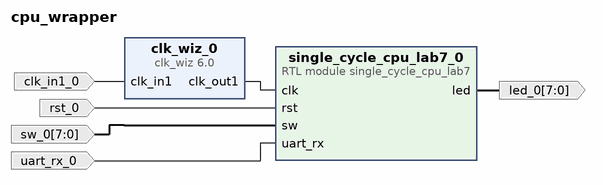
[diagram p0: block diagram of the top level]
# Vivado block design cpu_wrapper, xc7a35tcpg236-1, Vivado 2025.2
create_bd_design cpu_wrapper

create_bd_port -dir O -from 7 -to 0 led_0
create_bd_port -dir I -type rst rst_0
create_bd_port -dir I -from 7 -to 0 sw_0
create_bd_port -dir I uart_rx_0
create_bd_port -dir I -type clk clk_in1_0

create_bd_cell -type module -reference single_cycle_cpu_lab7 single_cycle_cpu_lab7_0
create_bd_cell -type ip -vlnv xilinx.com:ip:clk_wiz:6.0 clk_wiz_0
set_property -dict [list \
  CONFIG.CLKOUT1_JITTER 290.478 \
  CONFIG.CLKOUT1_PHASE_ERROR 133.882 \
  CONFIG.CLKOUT1_REQUESTED_OUT_FREQ 10 \
  CONFIG.MMCM_CLKFBOUT_MULT_F 15.625 \
  CONFIG.MMCM_CLKOUT0_DIVIDE_F 78.125 \
  CONFIG.MMCM_DIVCLK_DIVIDE 2 \
  CONFIG.USE_LOCKED false \
  CONFIG.USE_RESET false \
] [get_bd_cells clk_wiz_0]

# ---- connections ----

connect_bd_net -net clk_in1_0_1 [get_bd_ports clk_in1_0] [get_bd_pins clk_wiz_0/clk_in1]
connect_bd_net [get_bd_pins clk_wiz_0/clk_out1] [get_bd_pins single_cycle_cpu_lab7_0/clk]
connect_bd_net -net rst_0_1 [get_bd_ports rst_0] [get_bd_pins single_cycle_cpu_lab7_0/rst]
connect_bd_net [get_bd_pins single_cycle_cpu_lab7_0/led] [get_bd_ports led_0]
connect_bd_net -net sw_0_1 [get_bd_ports sw_0] [get_bd_pins single_cycle_cpu_lab7_0/sw]
connect_bd_net -net uart_rx_0_1 [get_bd_ports uart_rx_0] [get_bd_pins single_cycle_cpu_lab7_0/uart_rx]

validate_bd_design
save_bd_design
